# EAGLE design v2 (EAGLE 9.2.0)
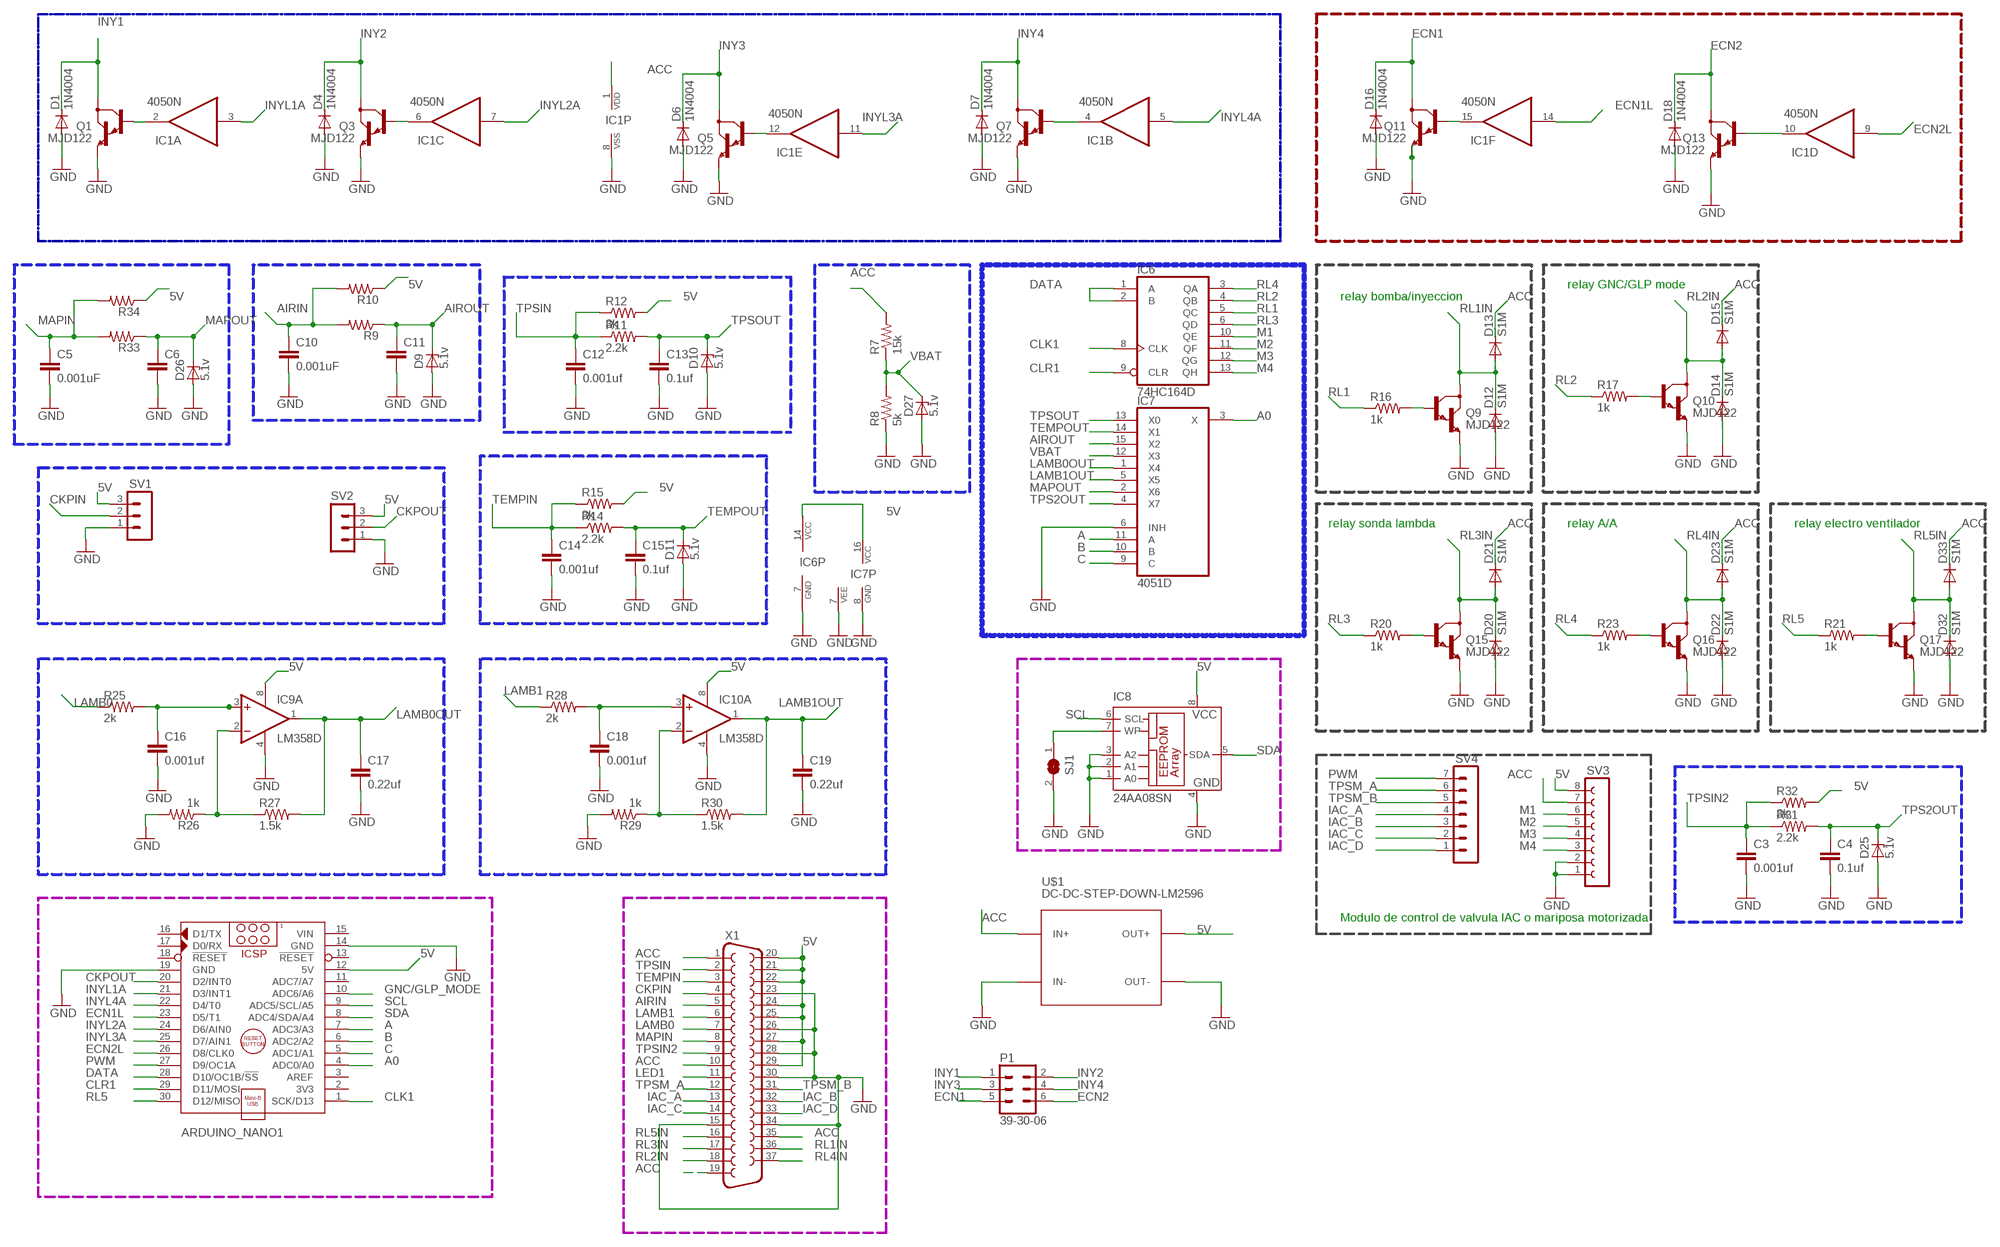
[diagram p0: schematic, sheet 1]

## Parts
ARDUINO_NANO1  ARDUINO_NANO  [ARDUINO_NANO]
C3  0.001uf  C-EU025-025X050  [C025-025X050]
C4  0.1uf  C-EU025-025X050  [C025-025X050]
C5  0.001uF  C-EU025-025X050  [C025-025X050]
C6  C-EU025-025X050  [C025-025X050]
C10  0.001uF  C-EU025-025X050  [C025-025X050]
C11  C-EU025-025X050  [C025-025X050]
C12  0.001uf  C-EU025-025X050  [C025-025X050]
C13  0.1uf  C-EU025-025X050  [C025-025X050]
C14  0.001uf  C-EU025-025X050  [C025-025X050]
C15  0.1uf  C-EU025-025X050  [C025-025X050]
C16  0.001uf  C-EU025-025X050  [C025-025X050]
C17  0.22uf  C-EU025-025X050  [C025-025X050]
C18  0.001uf  C-EU025-025X050  [C025-025X050]
C19  0.22uf  C-EU025-025X050  [C025-025X050]
D1  1N4004  [DO41-10]
D4  1N4004  [DO41-10]
D6  1N4004  [DO41-10]
D7  1N4004  [DO41-10]
D9  5.1v  ZENER-DIODEZD-5  [ZDIO-5]
D10  5.1v  ZENER-DIODEZD-5  [ZDIO-5]
D11  5.1v  ZENER-DIODEZD-5  [ZDIO-5]
D12  S1M  [SMA]
D13  S1M  [SMA]
D14  S1M  [SMA]
D15  S1M  [SMA]
D16  1N4004  [DO41-10]
D18  1N4004  [DO41-10]
D20  S1M  [SMA]
D21  S1M  [SMA]
D22  S1M  [SMA]
D23  S1M  [SMA]
D25  5.1v  ZENER-DIODEZD-5  [ZDIO-5]
D26  5.1v  ZENER-DIODEZD-5  [ZDIO-5]
D27  5.1v  ZENER-DIODEZD-5  [ZDIO-5]
D32  S1M  [SMA]
D33  S1M  [SMA]
IC1  4050N  [DIL16]
IC6  74HC164D  [SO14]
IC7  4051D  [SO16]
IC8  24AA08SN  [SO-08]
IC9  LM358D  [SO08]
IC10  LM358D  [SO08]
P1  39-30-06  [39-30-?06?]
Q1  MJD122  [DPAK]
Q3  MJD122  [DPAK]
Q5  MJD122  [DPAK]
Q7  MJD122  [DPAK]
Q9  MJD122  [DPAK]
Q10  MJD122  [DPAK]
Q11  MJD122  [DPAK]
Q13  MJD122  [DPAK]
Q15  MJD122  [DPAK]
Q16  MJD122  [DPAK]
Q17  MJD122  [DPAK]
R7  15k  R-US_0204/5  [0204/5]
R8  5k  R-US_0204/5  [0204/5]
R9  R-US_0204/5  [0204/5]
R10  R-US_0204/5  [0204/5]
R11  2.2k  R-US_0204/5  [0204/5]
R12  3k  R-US_0204/5  [0204/5]
R14  2.2k  R-US_0204/5  [0204/5]
R15  3k  R-US_0204/5  [0204/5]
R16  1k  R-US_0204/5  [0204/5]
R17  1k  R-US_0204/5  [0204/5]
R20  1k  R-US_0204/5  [0204/5]
R21  1k  R-US_0204/5  [0204/5]
R23  1k  R-US_0204/5  [0204/5]
R25  2k  R-US_0204/5  [0204/5]
R26  1k  R-US_0204/5  [0204/5]
R27  1.5k  R-US_0204/5  [0204/5]
R28  2k  R-US_0204/5  [0204/5]
R29  1k  R-US_0204/5  [0204/5]
R30  1.5k  R-US_0204/5  [0204/5]
R31  2.2k  R-US_0204/5  [0204/5]
R32  3k  R-US_0204/5  [0204/5]
R33  R-US_0204/5  [0204/5]
R34  R-US_0204/5  [0204/5]
SJ1  SJW  [SJW]
SV1  MA03-1  [MA03-1]
SV2  MA03-1  [MA03-1]
SV3  FE08-1  [FE08]
SV4  MA07-1  [MA07-1]
U$1  DC-DC-STEP-DOWN-LM2596  [DC-DC-STEP-DOWN-LM2596]
X1  F37HP  [F37HP]

## Nets
5V: ARDUINO_NANO1.12(5V) IC6.14(VCC) IC7.16(VCC) IC8.8(VCC) IC9.8(P:V+) IC10.8(P:V+) R10.1 R12.2 R15.2 R32.2 R34.1 SV1.3 SV2.3 SV3.8 U$1.OUT+ X1.20 X1.21 X1.22 X1.24 X1.25 X1.27 X1.29
A: ARDUINO_NANO1.7(ADC3/A3) IC7.11(A)
A0: ARDUINO_NANO1.4(ADC0/A0) IC7.3(X)
ACC: D13.C D15.C D21.C D23.C D33.C IC1.1(P:VDD) R7.2 SV3.7 U$1.IN+ X1.1 X1.10 X1.19 X1.35
AIRIN: C10.1 R9.2 R10.2 X1.5
AIROUT: C11.1 D9.C IC7.15(X2) R9.1
B: ARDUINO_NANO1.6(ADC2/A2) IC7.10(B)
C: ARDUINO_NANO1.5(ADC1/A1) IC7.9(C)
CKPIN: SV1.2 X1.4
CKPOUT: ARDUINO_NANO1.20(D2/INT0) SV2.2
CLK1: ARDUINO_NANO1.1(SCK/D13) IC6.8(CLK)
CLR1: ARDUINO_NANO1.29(D11/MOSI) IC6.9(CLR)
DATA: ARDUINO_NANO1.28(D10/OC1B/!SS) IC6.1(A) IC6.2(B)
ECN1: D16.C P1.5 Q11.4(C)
ECN1L: ARDUINO_NANO1.23(D5/T1) IC1.14(F:I)
ECN2: D18.C P1.6 Q13.4(C)
ECN2L: ARDUINO_NANO1.26(D8/CLK0) IC1.9(D:I)
GNC/GLP_MODE: ARDUINO_NANO1.10(ADC6/A6)
GND: ARDUINO_NANO1.14(GND) ARDUINO_NANO1.19(GND) C3.2 C4.2 C5.2 C6.2 C10.2 C11.2 C12.2 C13.2 C14.2 C15.2 C16.2 C17.2 C18.2 C19.2 D1.A D4.A D6.A D7.A D9.A D10.A D11.A D12.A D14.A D16.A D18.A D20.A D22.A D25.A D26.A D27.A D32.A IC1.8(P:VSS) IC6.7(GND) IC7.6(INH) IC7.7(VEE) IC7.8(GND) IC8.1(A0) IC8.2(A1) IC8.3(A2) IC8.4(GND) IC9.4(P:V-) IC10.4(P:V-) Q1.3(E) Q3.3(E) Q5.3(E) Q7.3(E) Q9.3(E) Q10.3(E) Q11.3(E) Q13.3(E) Q15.3(E) Q16.3(E) Q17.3(E) R8.1 R26.2 R29.2 SJ1.2 SV1.1 SV2.1 SV3.1 SV3.2 U$1.IN- U$1.OUT- X1.15 X1.23 X1.26 X1.28 X1.30 X1.34
IAC_A: SV4.4 X1.13
IAC_B: SV4.3 X1.32
IAC_C: SV4.2 X1.14
IAC_D: SV4.1 X1.33
INY1: D1.C P1.1 Q1.4(C)
INY2: D4.C P1.2 Q3.4(C)
INY3: D6.C P1.3 Q5.4(C)
INY4: D7.C P1.4 Q7.4(C)
INYL1A: ARDUINO_NANO1.21(D3/INT1) IC1.3(A:I)
INYL2A: ARDUINO_NANO1.24(D6/AIN0) IC1.7(C:I)
INYL3A: ARDUINO_NANO1.25(D7/AIN1) IC1.11(E:I)
INYL4A: ARDUINO_NANO1.22(D4/T0) IC1.5(B:I)
LAMB0: R25.1 X1.7
LAMB0OUT: C17.1 IC7.1(X4) IC9.1(A:OUT) R27.2
LAMB1: R28.1 X1.6
LAMB1OUT: C19.1 IC7.5(X5) IC10.1(A:OUT) R30.2
LED1: X1.11
M1: IC6.10(QE) SV3.6
M2: IC6.11(QF) SV3.5
M3: IC6.12(QG) SV3.4
M4: IC6.13(QH) SV3.3
MAPIN: C5.1 R33.2 R34.2 X1.8
MAPOUT: C6.1 D26.C IC7.2(X6) R33.1
N$1: C18.1 IC10.3(A:+IN) R28.2
N$2: IC1.2(A:O) Q1.1(B)
N$3: IC1.6(C:O) Q3.1(B)
N$4: Q9.1(B) R16.2
N$5: IC1.12(E:O) Q5.1(B)
N$6: IC1.4(B:O) Q7.1(B)
N$7: Q17.1(B) R21.2
N$8: Q10.1(B) R17.2
N$9: IC1.15(F:O) Q11.1(B)
N$10: IC1.10(D:O) Q13.1(B)
N$19: Q15.1(B) R20.2
N$29: Q16.1(B) R23.2
N$31: C16.1 IC9.3(A:+IN) R25.2
N$32: IC9.2(A:-IN) R26.1 R27.1
N$34: IC8.7(WP) SJ1.1
N$37: IC10.2(A:-IN) R29.1 R30.1
PWM: ARDUINO_NANO1.27(D9/OC1A) SV4.7
RL1: IC6.5(QC) R16.1
RL1IN: D12.C D13.A Q9.4(C) X1.36
RL2: IC6.4(QB) R17.1
RL2IN: D14.C D15.A Q10.4(C) X1.18
RL3: IC6.6(QD) R20.1
RL3IN: D20.C D21.A Q15.4(C) X1.17
RL4: IC6.3(QA) R23.1
RL4IN: D22.C D23.A Q16.4(C) X1.37
RL5: ARDUINO_NANO1.30(D12/MISO) R21.1
RL5IN: D32.C D33.A Q17.4(C) X1.16
SCL: ARDUINO_NANO1.9(ADC5/SCL/A5) IC8.6(SCL)
SDA: ARDUINO_NANO1.8(ADC4/SDA/A4) IC8.5(SDA)
TEMPIN: C14.1 R14.1 R15.1 X1.3
TEMPOUT: C15.1 D11.C IC7.14(X1) R14.2
TPS2OUT: C4.1 D25.C IC7.4(X7) R31.2
TPSIN: C12.1 R11.1 R12.1 X1.2
TPSIN2: C3.1 R31.1 R32.1 X1.9
TPSM_A: SV4.6 X1.12
TPSM_B: SV4.5 X1.31
TPSOUT: C13.1 D10.C IC7.13(X0) R11.2
VBAT: D27.C IC7.12(X3) R7.1 R8.2
Unconnected: ARDUINO_NANO1.2(3V3) ARDUINO_NANO1.3(AREF) ARDUINO_NANO1.11(ADC7/A7) ARDUINO_NANO1.13(!RESET) ARDUINO_NANO1.16(D1/TX) ARDUINO_NANO1.17(D0/RX) ARDUINO_NANO1.18(!RESET) IC9.5(B:+IN) IC9.6(B:-IN) IC9.7(B:OUT) IC10.5(B:+IN) IC10.6(B:-IN) IC10.7(B:OUT)

## Buses
B$1

## Notes on the sheet
- relay GNC/GLP mode
- relay bomba/inyeccion
- relay sonda lambda | relay A/A | relay electro ventilador
- Modulo de control de valvula IAC o mariposa motorizada

## Power pins joined to a net without a drawn wire
VIN: ARDUINO_NANO1.15(VIN)

## Library data of the parts
ARDUINO_NANO1 = ArduinoNanoV30:ARDUINO_NANO: Arduino Nano V3.0 Module Overview: The Arduino Nano is a small, complete, and breadboard-friendly board based on the ATmega328 (Arduino Nano 3.x) or ATmega168 (Arduino Nano 2.x). It has more or less the same functionality of the Arduino Duemilanove, but in a different package. It lacks only a DC power jack, and works with a Mini-B USB cable instead of a standard one. The Nano was designed and is being produced by Gravitech <http://www.gravitech.us/arna30wiatp.html>. General specifications: Item Value Microcontroller Atmel ATmega168 or ATmega328 Operating Voltage (logic level) 5 V Input Voltage (recommended) 7-12 V Input Voltage (limits) 6-20 V Digital I/O Pins 14 (of which 6 provide PWM output) Analog Input Pins 8 DC Current per I/O Pin 40 mA Flash Memory 16 KB (ATmega168) or 32 KB (ATmega328) of which 2 KB used by bootloader SRAM 1 KB (ATmega168) or 2 KB (ATmega328) EEPROM 512 bytes (ATmega168) or 1 KB (ATmega328) Clock Speed 16 MHz Dimensions (Inches) 0.73" x 1.70" Dimensions (mm) 18mm x 45mm Overall height About 9 mm (not including pins) Weigth 5 g Power: The Arduino Nano can be powered via the Mini-B USB connection, 6-20V unregulated external power supply (pin 30), or 5V regulated external power supply (pin 27). The power source is automatically selected to the highest voltage source. Memory: The ATmega168 has 16 KB of flash memory for storing code (of which 2 KB is used for the bootloader); the ATmega328 has 32 KB, (also with 2 KB used for the bootloader). The ATmega168 has 1 KB of SRAM and 512 bytes of EEPROM (which can be read and written with the EEPROM library); the ATmega328 has 2 KB of SRAM and 1 KB of EEPROM. Input and Output: Each of the 14 digital pins on the Nano can be used as an input or output, using pinMode(), digitalWrite(), and digitalRead() functions. They operate at 5 volts. Each pin can provide or receive a maximum of 40 mA and has an internal pull-up resistor (disconnected by default) of 20-50 kOhms. In addition, some pins have specialized functions. Visit Arduino - ArduinoBoardNano <https://www.arduino.cc/en/Main/ArduinoBoardNano>
C3-C6 C10-C19 = rcl:C-EU: CAPACITOR, European symbol; SPICEPREFIX: C
D1 D4 D6 D7 D16 D18 = diode:1N4004: DIODE general purpose rectifier, 1 A
D9-D11 D25-D27 = diode:ZENER-DIODE: Z-Diode
D12-D15 D20-D23 D32 D33 = diode:S1M
IC1 = 40xx:4050: Hex non-inverting BUFFER
IC6 = 74xx-us:74*164: 8-bit parallel out SHIFT REGISTER
IC7 = 40xx:4051: 8-channel ANALOG MULTIPLEXER
IC8 = microchip:24*: Serial EEPROM I2C; MF: MICROCHIP; MPN: 24AA08-I/SN; OC_FARNELL: 1579568; OC_NEWARK: 92C6826
IC9 IC10 = linear:LM358: OP AMP also LM158; LM258; LM2904 Source: http://cache.national.com/ds/LM/LM158.pdf
P1 = con-molex-mini-fit:39-30-?06?: HEADER
Q1 Q3 Q5 Q7 Q9-Q11 Q13 Q15-Q17 = MJD122:MJD122: TRANS DARL NPN 100V 5A DPAK; AVAILABILITY: Unavailable; MF: STMicroelectronics; MP: MJD122; PACKAGE: None; PRICE: None
R7-R12 R14-R17 R20 R21 R23 R25-R34 = rcl:R-US_: RESISTOR, American symbol; SPICEPREFIX: R
SJ1 = jumper:SJ: SMD solder JUMPER
SV1 SV2 = con-lstb:MA03-1: PIN HEADER; OC_FARNELL: unknown; OC_NEWARK: unknown
SV3 = con-lsta:FE08-1: FEMALE HEADER; OC_FARNELL: unknown; OC_NEWARK: unknown
SV4 = con-lstb:MA07-1: PIN HEADER; OC_FARNELL: unknown; OC_NEWARK: unknown
U$1 = diy-modules:DC-DC-STEP-DOWN-LM2596: DC/DC Step-Down Regulator based on LM2596-ADJ chip LM2596 datasheet available here: http://www.ti.com/lit/ds/symlink/lm2596.pdf Click here to find device on ebay.com <http://www.ebay.com/sch/lm2596+power+regulator>
X1 = con-subd:F37: SUB-D; OC_FARNELL: unknown; OC_NEWARK: unknown

## Board
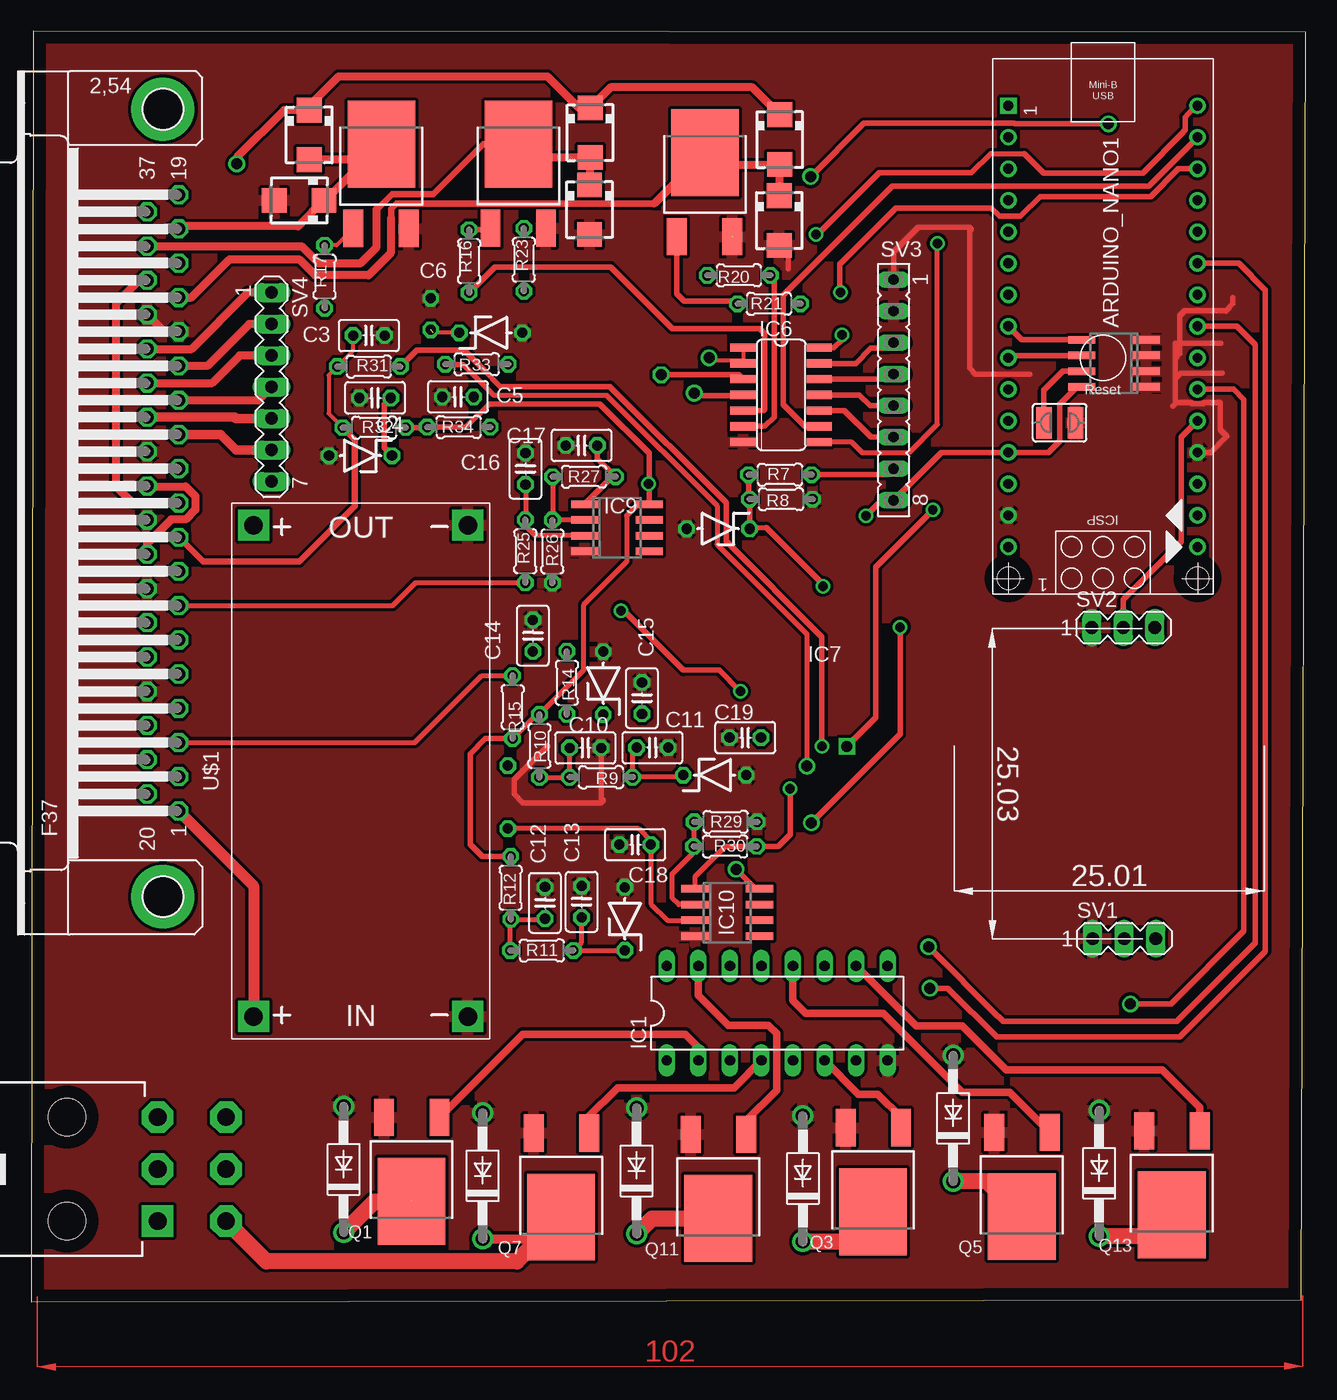
[diagram p1: board, top side]
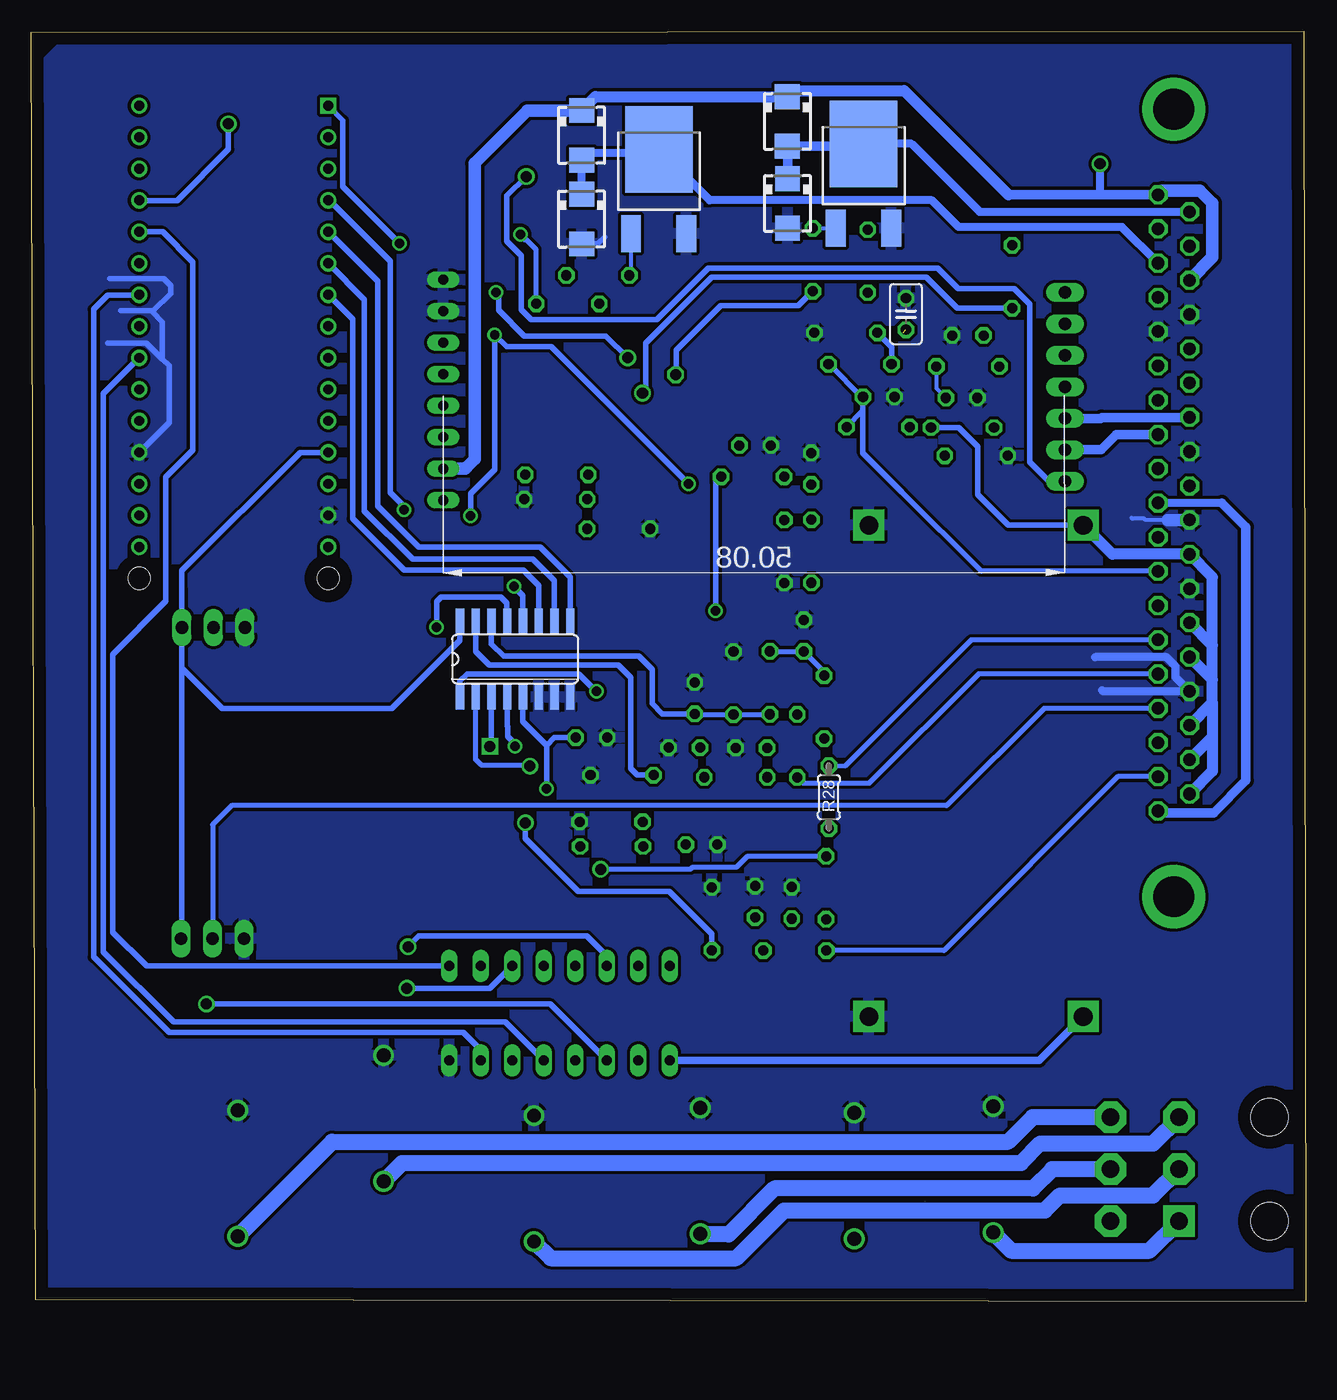
[diagram p2: board, bottom side, seen from below]

Size 102.75 x 102.47 mm. Coordinates in mm from the lower left corner, seen from the top.
Outline: 0,0 102.38,0.16 102.75,102.39 0.17,102.47 0,0
Copper layers (1*16): Top 0.035mm / dielectric 1.5mm / Bottom 0.035mm
Design rules "default *": minimum track width 12mil, minimum drill 0.35mm, track to track 10mil, track to pad 10mil, pad to pad 10mil, via to via 10mil, smd to smd 8mil, copper to edge 40mil, drill to drill 6mil, minimum pad ring 10mil, minimum via ring 8mil, stop-mask expansion 6mil, vias tented up to drill 0mil, thermal gap 10mil

### Footprints (pad centres in the part's own frame; a part is rotated, then mirrored left to right if it is on the bottom)
ARDUINO_NANO = drill 0.8 square: 1 -20.32,-7.62 | drill 0.8: 2 -17.78,-7.62; 3 -15.24,-7.62; 4 -12.7,-7.62; 5 -10.16,-7.62; 6 -7.62,-7.62; 7 -5.08,-7.62; 8 -2.54,-7.62; 9 0,-7.62; 10 2.54,-7.62; 11 5.08,-7.62; 12 7.62,-7.62; 13 10.16,-7.62; 14 12.7,-7.62; 15 15.24,-7.62; 16 15.24,7.62; 17 12.7,7.62; 18 10.16,7.62; 19 7.62,7.62; 20 5.08,7.62; 21 2.54,7.62; 22 0,7.62; 23 -2.54,7.62; 24 -5.08,7.62; 25 -7.62,7.62; 26 -10.16,7.62; 27 -12.7,7.62; 28 -15.24,7.62; 29 -17.78,7.62; 30 -20.32,7.62 | hole 1.778: 17.78,7.62; 17.78,-7.62
C025-025X050 = drill 0.813 octagon: 1 -1.27,0; 2 1.27,0
DO41-10 = drill 1.118: A 5.08,0; C -5.08,0
ZDIO-5 = drill 0.813 octagon: A 2.54,0; C -2.54,0
SMA = smd 2 x 2: A 2,0; C -2,0
DIL16 = drill 0.813 long: 1 -8.89,-3.81; 2 -6.35,-3.81; 3 -3.81,-3.81; 4 -1.27,-3.81; 5 1.27,-3.81; 6 3.81,-3.81; 7 6.35,-3.81; 8 8.89,-3.81; 9 8.89,3.81; 10 6.35,3.81; 11 3.81,3.81; 12 1.27,3.81; 13 -1.27,3.81; 14 -3.81,3.81; 15 -6.35,3.81; 16 -8.89,3.81
SO14 = smd 0.66 x 2.032: 1 -3.81,-3.073; 2 -2.54,-3.073; 3 -1.27,-3.073; 4 0,-3.073; 5 1.27,-3.073; 6 2.54,-3.073; 7 3.81,-3.073; 8 3.81,3.073; 9 2.54,3.073; 10 1.27,3.073; 11 0,3.073; 12 -1.27,3.073; 13 -2.54,3.073; 14 -3.81,3.073
SO16 = smd 0.66 x 2.032: 1 -4.445,-3.073; 2 -3.175,-3.073; 3 -1.905,-3.073; 4 -0.635,-3.073; 5 0.635,-3.073; 6 1.905,-3.073; 7 3.175,-3.073; 8 4.445,-3.073; 9 4.445,3.073; 10 3.175,3.073; 11 1.905,3.073; 12 0.635,3.073; 13 -0.635,3.073; 14 -1.905,3.073; 15 -3.175,3.073; 16 -4.445,3.073
SO-08 = smd 0.6 x 2.2: 1 -1.905,-2.6; 2 -0.635,-2.6; 3 0.635,-2.6; 4 1.905,-2.6; 5 1.905,2.6; 6 0.635,2.6; 7 -0.635,2.6; 8 -1.905,2.6
SO08 = smd 0.6 x 2.2: 1 -1.905,-2.6; 2 -0.635,-2.6; 3 0.635,-2.6; 4 1.905,-2.6; 5 1.905,2.6; 6 0.635,2.6; 7 -0.635,2.6; 8 -1.905,2.6
39-30-?06? = drill 1.422 pad 2.54 square: 1 4.191,0 | drill 1.422 pad 2.54 octagon: 2 0,0; 3 -4.191,0; 4 4.191,5.512; 5 0,5.512; 6 -4.191,5.512 | hole 3: -4.191,-7.3; 4.191,-7.3
DPAK = smd 1.6 x 2.997: 1 -2.261,-4.928; 3 2.21,-4.928 | smd 5.452 x 7: 4 0,1.853
0204/5 = drill 0.813 octagon: 1 -2.54,0; 2 2.54,0
SJW = smd 1.27 x 2.54: 1 -1.27,0; 2 1.27,0
MA03-1 = drill 1.016 long: 1 -2.54,0; 2 0,0; 3 2.54,0
FE08 = drill 0.813 long: 1 -8.89,0; 2 -6.35,0; 3 -3.81,0; 4 -1.27,0; 5 1.27,0; 6 3.81,0; 7 6.35,0; 8 8.89,0
MA07-1 = drill 1.016 long: 1 -7.62,0; 2 -5.08,0; 3 -2.54,0; 4 0,0; 5 2.54,0; 6 5.08,0; 7 7.62,0
DC-DC-STEP-DOWN-LM2596 = drill 1.5 pad 2.5 square: IN+ -19.812,8.636; IN- -19.812,-8.636; OUT+ 19.812,8.636; OUT- 19.812,-8.636
F37HP = drill 1.016 octagon: 1 -24.841,-1.27; 2 -22.073,-1.27; 3 -19.329,-1.27; 4 -16.561,-1.27; 5 -13.792,-1.27; 6 -11.049,-1.27; 7 -8.28,-1.27; 8 -5.512,-1.27; 9 -2.769,-1.27; 10 0,-1.27; 11 2.769,-1.27; 12 5.512,-1.27; 13 8.28,-1.27; 14 11.049,-1.27; 15 13.818,-1.27; 16 16.561,-1.27; 17 19.329,-1.27; 18 22.098,-1.27; 19 24.841,-1.27; 20 -23.47,1.27; 21 -20.701,1.27; 22 -17.932,1.27; 23 -15.189,1.27; 24 -12.421,1.27; 25 -9.652,1.27; 26 -6.909,1.27; 27 -4.14,1.27; 28 -1.372,1.27; 29 1.372,1.27; 30 4.14,1.27; 31 6.909,1.27; 32 9.677,1.27; 33 12.421,1.27; 34 15.189,1.27; 35 17.958,1.27; 36 20.701,1.27; 37 23.47,1.27 | drill 3.302 pad 5.08: G1 -31.75,0; G2 31.75,0

### Placement (x,y rotation side)
ARDUINO_NANO1  86.41,76.12 270 top
C3  27.23,77.92 0 top
C4  27.73,72.89 180 top
C5  34.42,72.97 180 top
C6  32.22,79.65 90 bottom
C10  44.68,44.67 0 top
C11  50.09,44.68 0 top
C12  41.43,32.17 90 top
C13  44.39,32.26 90 top
C14  40.46,53.71 90 top
C15  49.25,48.68 90 top
C16  39.86,67.17 90 top
C17  44.38,69.06 180 top
C18  48.7,36.87 180 top
C19  57.57,45.5 180 top
D1  25.2,10.67 90 top
D4  62.21,9.94 90 top
D6  74.33,14.8 90 top
D7  36.4,10.16 90 top
D9  55.11,42.47 0 top
D10  47.86,30.89 90 top
D11  46.13,49.88 90 top
D12  45.02,88.07 270 top
D13  45.07,94.27 270 top
D14  21.62,88.81 180 top
D15  22.42,94.09 270 top
D16  48.81,10.56 90 top
D18  86.1,10.37 90 top
D20  58.37,87.31 270 bottom
D21  58.37,94.06 270 bottom
D22  41.77,88.56 270 bottom
D23  41.78,95.18 270 bottom
D25  26.56,68.23 180 top
D26  37.06,78.14 0 top
D27  55.39,62.33 180 top
D32  60.32,87.19 270 top
D33  60.36,93.71 270 top
IC1  60.15,23.28 0 top
IC6  60.46,73.13 270 top
IC7  63.73,51.83 0 bottom
IC8  87.29,75.68 90 top
IC9  47.23,62.41 270 top
IC10  56.13,31.39 270 top
P1  39-30-06?  [39-30-?06?]  10.21,10.69 270 top
Q1  30.67,9.96 180 top
Q3  67.87,9.12 180 top
Q5  79.85,8.73 180 top
Q7  42.73,8.68 180 top
Q9  39.3,91.49 0 top
Q10  28.24,91.48 0 top
Q11  55.4,8.58 180 top
Q13  91.95,8.87 180 top
Q15  52.13,91.06 0 bottom
Q16  35.63,91.51 0 bottom
Q17  54.32,90.8 0 top
R7  60.37,66.69 0 top
R8  60.45,64.71 180 top
R9  45.95,42.3 180 top
R10  40.98,44.83 270 top
R11  41.18,28.33 0 top
R12  38.66,33.39 90 top
R14  43.19,49.92 270 top
R15  38.82,47.95 270 top
R16  35.31,83.91 90 top
R17  23.67,82.65 90 top
R20  57.06,82.77 180 top
R21  59.49,80.48 180 top
R23  39.73,84.02 90 top
R25  39.84,60.52 90 top
R26  42.02,60.51 270 top
R27  44.58,66.53 0 top
R28  38.44,40.69 270 bottom
R29  55.99,38.71 0 top
R30  55.95,36.72 0 top
R31  27.23,75.42 0 top
R32  27.67,70.5 0 top
R33  35.93,75.6 0 top
R34  34.47,70.54 0 top
SJ1  82.91,70.89 0 top
SV1  88.12,29.29 0 top
SV2  88.04,54.37 0 top
SV3  69.52,73.52 270 top
SV4  19.39,73.77 270 top
U$1  26.57,42.81 90 top
X1  10.64,64.42 90 top

### Tracks (layer width: path | path; a pad name or v marks a point on that pad's centre or on a via)
5V  (via drill 0.76, 0.89)
  Top 0.406: 37.98,45.41 R15.2 40.77,47.37 R10.1 44.56,50.95 44.56,56.22 48.02,59.68 48.02,63.39 48.95,64.32 IC9.8 | 37.71,35.93 R12.2 | 33.84,70.5 31.88,70.5 | IC10.8 58.42,33.3 v56.84,34.88
  Top 0.457: IC8.8 84.3,73.77 82.9,72.37 82.9,69.4 82,68.5 ARDUINO_NANO1.12 73.39,68.5 SV3.8 68.56,64.63 v67.31,63.38 | R32.2 31.88,70.5 R34.1 35.06,70.54 36.92,72.4 45.85,72.4 49.83,68.43 49.83,65.9 | IC9.8 49.83,65.9 | 49.83,65.9 v49.75,65.97 | v65.37,77.97 65.37,77.59 64.72,76.94 IC6.14 | R12.2 36.36,35.93 35.38,36.9 35.38,44.18 36.61,45.41 R15.2
  Top 0.635: X1.27 9.37,61.16 11.29,63.09 12.46,63.09 13.24,63.87 13.24,64.97 12.46,65.75 9.4,65.75 X1.29
  Bottom 0.406: R12.2 45,35.93 45.9,35.03 49.44,35.03 49.57,34.89 56.83,34.89 v56.84,34.88
  Bottom 0.457: ARDUINO_NANO1.12 81.06,68.5 90.58,58.98 90.58,57.49 SV2.3 90.58,51.1 | 90.58,51.1 90.58,29.37 SV1.3 | R32.2 27.95,70.5 26.43,68.98 26.43,65.1 23.96,62.63 U$1.OUT+ | IC7.16 68.17,53.33 73.67,47.84 87.32,47.84 90.58,51.1 | 67.25,63.27 67.31,63.33 v67.31,63.38 67.31,65.17 65.37,67.1 v65.37,77.97 64.42,77.02 60.8,77.02 v49.75,65.97 | 67.23,63.24 67.25,63.27 | 67.25,63.27 67.25,63.33
  Bottom 0.889: U$1.OUT+ 15.59,60.28 X1.27 7.53,58.44 7.53,52.93 | X1.22 7.53,48.32 | 7.53,50.16 X1.24 | 7.53,48.32 7.53,50.16 | 7.53,50.16 7.53,52.93 | 7.53,52.93 X1.25 | 7.53,48.32 7.53,45.55 | 7.53,45.55 X1.21 | 7.53,45.55 7.53,42.79 X1.20
A
  Bottom 0.457: IC7.11 61.82,57.76 63.07,59 72.68,59 76.82,63.14 76.82,79.23 ARDUINO_NANO1.7
A0  (via drill 0.76, 0.89)
  Top 0.457: v72.68,63.85 68.09,59.26 68.09,47.11 v65.76,44.78
  Bottom 0.457: v65.76,44.78 65.63,44.91 IC7.3 | v72.68,63.85 72.68,64.12 73.81,65.25 73.81,83.9 78.73,88.82 ARDUINO_NANO1.4
ACC  (via drill 0.89)
  Top 0.457: SV3.7 69.04,66.69 R7.2
  Top 0.635: D33.C 58.15,97.92 46.71,97.92 D13.C 44.16,96.27 41.63,98.8 24.78,98.8 22.42,96.44 D15.C 20.4,96.09 16.58,92.28 v16.58,91.76 | X1.10 9.95,64.42 | 9.95,64.42 | 9.96,64.41 9.96,64.42 9.95,64.42 | 9.95,64.42 8.21,64.42 6.88,65.76 6.88,80.54 8.72,82.38 X1.35
  Top 0.889: X1.1 17.94,33.54 U$1.IN+
  Bottom 0.61: IC1.1 21.47,19.47 U$1.IN+
  Bottom 0.635: 6.77,64.42 X1.10 | 11.75,39.42 X1.1 | v16.58,91.76 16.58,89.3 16.62,89.26
  Bottom 0.762: X1.19 16.62,89.26 23.98,89.26 | SV3.7 67.79,67.17 67.64,67.32 | 11.75,39.42 7.43,39.42 4.83,42.02 4.83,62.48 6.77,64.42
  Bottom 0.889: D21.C 57.25,97.18 D23.C 41.3,97.66 32.38,97.66 23.98,89.26 | X1.19 11.7,89.46 | 69.55,67.2 SV3.7
  Bottom 1.016: D21.C 62.75,96.06 67,91.81 67,67.96 67.64,67.32 67.76,67.2 69.55,67.2 | X1.19 11.56,89.61 8.53,89.61 7.52,88.6 7.52,84.22 X1.35
AIRIN
  Top 0.406: R10.2 43.39,42.29 R9.2 C10.1
  Bottom 0.406: X1.5 26.37,50.63 35.17,41.82 40.51,41.82 R10.2
AIROUT
  Top 0.406: C11.1 48.49,44.35 R9.1 52.4,42.3 D9.C
  Bottom 0.457: 58.44,51.36 58.45,51.35 | IC7.15 66.9,52.45 65.8,51.35 58.45,51.35 | D9.C 53.89,42.47 54.41,42.99 54.41,50.36 55.4,51.35 58.45,51.35
B
  Bottom 0.457: IC7.10 60.55,58.15 62.3,59.89 71.99,59.89 75.87,63.78 75.87,80.83 ARDUINO_NANO1.6
C
  Bottom 0.457: IC7.9 59.28,58.43 61.71,60.85 71.5,60.85 74.82,64.17 74.82,82.31 ARDUINO_NANO1.5
CKPIN
  Bottom 0.406: X1.4 21.1,47.86 28.94,40.02 86.58,40.02 88.12,38.48 SV1.2
CKPOUT
  Top 0.457: SV2.2 88.04,56.62 92.72,61.3 92.72,69.73 ARDUINO_NANO1.20
CLK1  (via drill 0.76)
  Top 0.406: v73.05,85.36 73.05,70.77 70.74,68.46 67.03,68.46 66.17,69.32 IC6.8
  Bottom 0.406: ARDUINO_NANO1.1 77.6,95.26
  Bottom 0.457: 77.6,95.26 77.6,89.91 v73.05,85.36
CLR1
  Top 0.457: IC6.9 62.4,70.59 60.63,72.36 60.63,81.17 69.42,89.95 90.08,89.95 ARDUINO_NANO1.29
DATA  (via drill 0.76, 0.89)
  Top 0.305: IC6.2 IC6.1 57.39,75.9 54.88,75.9 v54.65,76.12
  Top 0.457: ARDUINO_NANO1.28 92.49,91.36 90.25,89.12 81.35,89.12 79.75,87.52 78.07,87.52 77.41,88.18 69.71,88.18 65.19,83.66 65.19,81.45 v65.26,81.38
  Bottom 0.457: v54.65,76.12 56.4,77.88 62.98,77.88 65.07,79.96 65.07,81.19 v65.26,81.38
ECN1
  Top 1.27: D16.C 50.06,6.72 Q11.4
  Bottom 1.27: P1.5 20.45,10.7 22,9.14 42.82,9.14 46.53,5.44 48.77,5.44 D16.C
ECN1L  (via drill 0.89)
  Top 0.457: ARDUINO_NANO1.23 97.2,78.66 98.67,77.18 98.67,28.94 92.34,22.61 78.38,22.61 77.96,23.03 77.94,23.03 v72.35,28.62
  Bottom 0.457: v72.35,28.62 71.48,29.49 57.94,29.49 56.34,27.89 IC1.14
ECN2
  Top 1.27: D18.C 90.22,5.29 Q13.4
  Bottom 1.27: P1.6 22.02,14.89 24,12.91 78.47,12.91 D18.C
ECN2L
  Bottom 0.457: IC1.9 93.44,27.09 96.16,29.81 96.16,52.21 91.88,56.49 91.88,66.51 89.71,68.68 89.71,83.85 92.15,86.28 ARDUINO_NANO1.26
GND  (1 unrouted)
  Top 0.457: ARDUINO_NANO1.19 95.11,68.5 96.4,69.79 95.87,70.32 95.87,72.49 94.54,72.49 94.5,72.44 93.56,72.44 93.51,72.49 92.3,72.49 92.22,72.41 | 92.02,72.21 92.22,72.41 | 92.22,72.41 92.22,74.41 | 92.22,74.41 92.69,74.88 96.01,74.88 | 95.89,77.31 92.27,77.31 92.22,77.25 92.22,76.05 | 92.22,74.41 92.22,76.05 | 92.22,76.05 92.61,76.44 92.61,79.54 93,79.93 96.28,79.93 96.28,79.9 96.87,80.48 96.87,80.96 | D32.A 61.03,84.48 61.03,83.31 | C10.2 45.95,40.6 46.12,40.44 45.92,40.24 39.63,40.24 38.93,40.94 38.93,42.11 41.63,44.81 | SV3.1 69.52,84.67 71.5,86.65 75.63,86.65 75.78,86.5 75.66,86.39 75.66,75.28 76.13,74.82 80.52,74.82
  Top 0.635: X1.34 10.74,78.24 X1.15
  Bottom 0.305: 14.06,63.22 14.05,63.22 13.97,63.14 13.01,63.14 12.92,63.05 10.36,63.05
  Bottom 0.457: ARDUINO_NANO1.19 91.61,70.91 91.61,75.48 92.16,76.03 | 92.16,76.03 93.45,77.32 96.56,77.32 | 92.16,76.03 92.16,79.01 92.98,79.83 92.88,79.93 | 95.53,79.93 92.88,79.93 | 92.88,79.93 91.49,81.31 91.49,81.96 92.05,82.51 96.4,82.51 | D20.A 57.05,85.31 56.5,85.86
  Bottom 0.635: 16.41,49.31 16.33,49.23 X1.23 10.5,50.36 10.5,51.24 11.24,51.99 16.98,51.99
  Bottom 1.016: X1.28 10.36,63.05 11.11,63.05 11.12,63.05
  pour Top: 3.04,104.56 -8.53,92.98 -8.53,4.37 -2.04,-2.12 101.34,-2.12 104.43,0.96 104.43,99.53 99.4,104.56
  pour Bottom: -1.2,100.32 0.16,101.68 99.76,101.68 105.38,96.05 105.38,3.12 100.14,-2.12 -0.77,-2.12 -1.2,-1.7
IAC_A
  Top 0.635: X1.13 18.33,72.7 SV4.4
IAC_B
  Top 0.635: X1.32 14.61,74.1 16.82,76.31 SV4.3
IAC_C
  Top 0.635: X1.14 14.2,75.47 17.58,78.85 SV4.2
IAC_D
  Top 0.635: X1.33 12.94,76.84 17.49,81.39 SV4.1
INY1  (1 unrouted)
  Top 1.27: 30.65,8.06 30.68,8.09 27.7,8.09 D1.C | 30.42,8.23 30.55,8.23 Q1.4 31.29,8.73 31.78,8.73
  Bottom 1.27: P1.1 12.6,4.12 23.74,4.12 25.2,5.58 D1.C
INY2
  Top 1.27: D4.C 65.81,4.86 68.37,7.41 67.9,7.88 | 67.9,7.88 | Q3.4 67.87,7.84 67.9,7.88
  Bottom 1.27: P1.2 12.33,8.58 19.82,8.58 21.03,7.38 42.04,7.38 45.91,3.51 60.87,3.51 D4.C
INY3
  Top 1.27: Q5.4 77.02,9.72 D6.C
  Bottom 1.27: P1.3 10.21,14.85 12.29,12.77 21.38,12.77 22.96,11.19 72.86,11.19 D6.C
INY4
  Top 0.762: P1.4 15.74,6.49 | D7.C 40.94,5.04 Q7.4
  Top 1.27: P1.4 18.98,3.25 39.15,3.25 Q7.4
INYL1A  (via drill 0.89)
  Top 0.457: ARDUINO_NANO1.21 96.93,73.58 97.77,72.74 97.77,29.89 91.89,24.01 v88.61,24.01
  Bottom 0.457: IC1.3 60.88,24.01 v88.61,24.01
INYL2A
  Bottom 0.457: ARDUINO_NANO1.24 94.05,81.17 96.57,81.17 97.69,80.04 97.69,27.8 91.62,21.73 67.9,21.73 66.5,20.32 IC1.7
INYL3A  (via drill 0.89)
  Top 0.457: ARDUINO_NANO1.25 97.36,83.74 99.5,81.59 99.5,28.27 92.58,21.35 77.82,21.35 73.91,25.26 72.48,25.26 v72.46,25.28
  Bottom 0.457: v72.46,25.28 65.76,25.28 IC1.11
INYL4A
  Bottom 0.457: ARDUINO_NANO1.22 96.92,73.22 96.92,28.22 91.26,22.56 64.51,22.56 IC1.5
LAMB0
  Top 0.406: X1.7 29.16,56.14 31,57.98 R25.1
LAMB0OUT  (via drill 0.76)
  Top 0.457: C17.1 45.65,68 R27.2 46.84,66.53 IC9.1 | v57.19,49.23 55.47,50.94 52.58,50.94 47.79,55.73 v47.56,55.73
  Bottom 0.457: IC7.1 68.17,50.06 67.6,50.64 58.59,50.64 v57.19,49.23 | R27.2 47.56,66.09 v47.56,55.73
LAMB1
  Bottom 0.406: X1.6 26.96,53.37 34.15,46.18 37.14,43.22 R28.1
LAMB1OUT  (via drill 0.76)
  Top 0.406: 55.97,36.72 53.53,34.28 IC10.1
  Top 0.457: v61.19,41.38 | 55.97,36.72 R30.2 60.22,36.72 61.19,37.7 v61.19,41.38
  Bottom 0.457: 61.19,44.87 63.09,46.78 IC7.5 | C19.1 60.57,45.5 61.19,44.87 | 61.19,44.87 v61.19,41.38
M1
  Top 0.457: SV3.6 67.71,69.71 65.56,71.86 IC6.10
M2
  Top 0.457: IC6.11 66.76,73.13 67.64,72.25 SV3.5
M3
  Top 0.457: IC6.12 69.13,74.4 SV3.4
M4
  Top 0.457: IC6.13 66.48,75.67 67.7,76.89 69.08,76.89 SV3.3
MAPIN
  Bottom 0.406: X1.8 26.15,58.91 32.56,65.31 32.75,65.5 | R34.2 35.69,71.87 C5.1 35.78,72.97 38.42,75.6 R33.2
  Bottom 0.457: 32.56,65.31 35.69,68.44 C5.1
MAPOUT  (via drill 0.89)  (1 unrouted)
  Top 0.305: D26.C 32.43,78.14
  Top 0.406: 34.01,75.58 33.99,75.6 R33.1 | v62.55,43.19 62.55,53.84 55.31,61.08 55.31,64.2 46.42,73.09 37.32,73.09 34.83,75.58
  Top 0.457: 34.83,75.58 34.01,75.58
  Bottom 0.406: v62.55,43.19 62.63,43.28 66.45,43.28 66.9,43.73 IC7.2
  Bottom 0.457: D26.C 33.39,77 R33.1
N$1
  Top 0.406: IC10.3 51.31,30.76 49.97,32.1 C18.1 49.97,37.16 48.97,38.15 R28.2
N$2
  Top 0.61: IC1.2 53.8,20.53 52.74,21.58 39.62,21.58 Q1.1
N$3
  Top 0.61: IC1.6 66.68,16.75 68.26,16.75 70.13,14.88 Q3.1
N$4
  Top 0.305: 36.89,86.41 Q9.1
  Top 0.457: R16.2 36.92,86.45 Q9.1
N$5
  Top 0.61: Q5.1 78.89,16.89 75.08,16.89 68.69,23.27 62.44,23.27 61.42,24.29 IC1.12
N$6
  Top 0.61: 44.84,13.46 44.84,14.83 47.27,17.26 56.67,17.26 IC1.4 | 44.84,13.1 44.84,13.46 | 44.84,13.46 Q7.1
N$7
  Top 0.305: Q17.1 52.11,85.83
  Top 0.457: R21.2 56.72,80.71 52.64,80.71 52.06,81.29 Q17.1
N$8
  Top 0.305: R17.2 24.62,85.19 Q10.1
N$9
  Top 0.61: 57.69,12.87 57.69,13.47 Q11.1 57.66,14.62 60.1,17.07 60.1,19.97 60.09,19.98 60.09,21.66 59.44,22.31 56.22,22.31 53.8,24.73 IC1.15
N$10
  Top 0.61: IC1.10 71.34,22.24 75.06,22.24 78.6,18.7 91.19,18.7 94.21,15.68 Q13.1
N$19
  Bottom 0.305: Q15.1 54.42,86.11 54.42,82.86 R20.2
N$29
  Bottom 0.305: R23.2 37.92,86.56 Q16.1
N$31
  Top 0.406: IC9.3 40.66,61.78 39.84,62.6 R25.2 39.86,63.08 C16.1
N$32
  Top 0.406: IC9.2 R26.1 | R26.1 | R26.1 42.04,63.06 R27.1
N$34
  Top 0.457: SJ1.1 81.64,73.53 83.15,75.04 IC8.7
N$37
  Top 0.406: IC10.2 52.21,32.03 51.66,32.58 51.66,34.48 53.41,36.23 R30.1 53.41,38.67 R29.1
PWM  (via drill 0.89)
  Top 0.457: v62.83,90.74 67.13,95.03 79.26,95.03 79.28,95.01 86.81,95.01 v86.85,94.98
  Bottom 0.457: v86.85,94.98 86.85,92.93 90.97,88.81 94.02,88.81 ARDUINO_NANO1.27 | v62.83,90.74 64.39,89.17 64.39,85.53 63.23,84.36 63.23,80.01 62.41,79.19 52.3,79.19 48.16,83.33 29.67,83.33 28.03,81.69 23.5,81.69 22.25,80.44 22.25,67.71 20.69,66.15 SV4.7
RL1
  Top 0.457: R16.1 37.37,83.43 46.72,83.43 51.68,78.48 58.74,78.48 59.16,78.05 59.16,72 59.02,71.86 IC6.5
RL1IN
  Top 0.508: Q9.4 36.45,93.34 32.44,89.33 29.11,89.33 27.86,88.08
  Top 0.635: Q9.4 40.37,92.27 D13.A 45.02,92.22 D12.C | X1.36 21.82,85.12 23.21,83.72 26.53,83.72 27.86,85.05 27.86,88.08
RL2  (via drill 0.89)
  Top 0.457: 57.32,73.2 IC6.4 57.35,73.09 53.64,73.09 v53.46,73.27
  Bottom 0.457: R17.1 28.08,80.12 30.58,82.62 47.87,82.62 53.19,77.3 53.19,73.54 v53.46,73.27
RL2IN
  Top 0.508: Q10.4 28.13,93.33
  Top 0.635: D15.A 27,92.09 Q10.4 23.73,88.81 D14.C 21.53,86.72 12.11,86.72 X1.18
RL3
  Top 0.457: R20.1 59.6,82.62 59.89,82.33 59.89,71.35 59.13,70.6 IC6.6
RL3IN
  Bottom 0.635: 52.58,92.43 52.58,92.65 | 52.58,92.65 52.31,92.92 Q15.4 48.04,88.83 30.14,88.83 27.98,86.67 14.83,86.67 X1.17 | 52.58,92.65 57.78,92.65 D21.A D20.C
RL4  (via drill 0.89)
  Top 0.457: v50.79,74.76 57.03,74.76 IC6.3
  Bottom 0.457: v50.79,74.76 50.74,74.8 50.74,76.73 47.15,80.31 40.89,80.31 R23.1
RL4IN
  Bottom 0.635: Q16.4 31.76,93.37 26.28,87.89 X1.37
  Bottom 0.762: Q16.4 35.82,93.18 D23.A 41.77,93.16 D22.C
RL5  (via drill 0.76)
  Top 0.406: ARDUINO_NANO1.30 93.93,96.44 93.29,95.8 | 77.35,92.58 80.06,92.58
  Top 0.457: v63.28,86.08 63.42,86.08 68.37,91.04 75.8,91.04 77.35,92.58 | 93.29,95.8 93.03,95.54 93.03,94.51 92.89,94.37 92.89,94.3 89.6,91.01 81.62,91.01 80.06,92.58
  Bottom 0.406: 62.92,85.61 63.28,85.97 v63.28,86.08 62.06,84.87 62.06,80.48 R21.1
RL5IN
  Top 0.508: 50.23,88.57 29.44,88.57 29.03,88.16 29.03,87.37
  Top 0.635: D32.C 60.36,89.23 D33.A 55.27,91.71 Q17.4 50.23,88.57 | X1.16 12.93,80.98 16.01,84.06 21.61,84.06 22.9,82.78 27.2,82.78 29.03,84.61 29.03,87.37
SCL
  Top 0.457: IC8.6 78.98,76.31 ARDUINO_NANO1.9
SDA
  Top 0.457: ARDUINO_NANO1.8 79.86,77.58 IC8.5
TEMPIN
  Top 0.406: X1.3 30.94,45.09 36.34,50.49 R15.1
  Bottom 0.406: R14.1 43.17,52.44 C14.1 38.82,50.8 R15.1
TEMPOUT
  Bottom 0.406: R14.2 46.09,47.38 D11.C 49.18,47.34 C15.1
  Bottom 0.457: IC7.14 65.63,53.05 64.64,52.06 58.75,52.06 58.74,52.07 53.78,52.07 52.69,50.98 52.69,48.25 51.85,47.41 C15.1
TPS2OUT  (via drill 0.76)
  Top 0.457: v63.75,44.79 63.75,53.61 56.02,61.34 56.02,64.46 46.67,73.81 37.82,73.81 36.47,75.16 | 36.47,75.16 35.8,75.84 35.8,75.87 34.93,76.75 31.1,76.75 R31.2 | 36.48,75.16 36.47,75.16 | C4.1 28.46,72.35 28.46,68.86 D25.C
  Bottom 0.305: C4.1 29.77,73.66 R31.2
  Bottom 0.457: IC7.4 64.36,46.43 64.33,46.4 64.33,45.6 63.75,45.02 v63.75,44.79
TPSIN
  Top 0.406: R11.1 38.64,30.82 R12.1 41.38,30.85 C12.1
  Bottom 0.406: X1.2 15.13,42.35 29.15,28.33 R11.1
TPSIN2
  Top 0.305: R32.1 24,71.63 24,74.72 R31.1 25.96,76.69 C3.1
  Top 0.508: X1.9 13.88,59.68 21.61,59.68 26.09,64.15 26.09,69.54 R32.1
TPSM_A
  Top 0.762: X1.12 15.29,69.93 16.54,68.69 SV4.6
  Bottom 0.635: 11.97,69.87 X1.12
  Bottom 0.762: 11.92,69.94 X1.12 15.29,69.93 16.49,68.73 19.35,68.73 SV4.6
TPSM_B
  Top 0.762: X1.31 16.42,71.33 16.52,71.23 SV4.5
  Bottom 0.762: SV4.5 16.54,71.23 16.45,71.31 9.38,71.31 X1.31
TPSOUT  (via drill 0.76, 0.89)
  Top 0.406: D10.C 47.84,28.33 R11.2 44.39,29 C13.1
  Top 0.457: v62.9,38.63 70.06,45.78 v70.06,54.41
  Bottom 0.457: v70.06,54.41 70.06,56.45 69.7,56.82 64.87,56.82 64.4,56.35 64.4,54.95 IC7.13 | D10.C 47.86,29.65 51.3,33.09 58.64,33.09 62.9,37.36 v62.9,38.63
VBAT  (via drill 0.76)
  Top 0.457: R7.1 57.83,64.79 R8.2 57.91,63.31 D27.C 59.28,62.42 63.82,57.87 v63.82,57.69
  Bottom 0.457: v63.82,57.69 63.09,56.96 IC7.12
(copper drawn outside any net)
  shapes: Top area x1